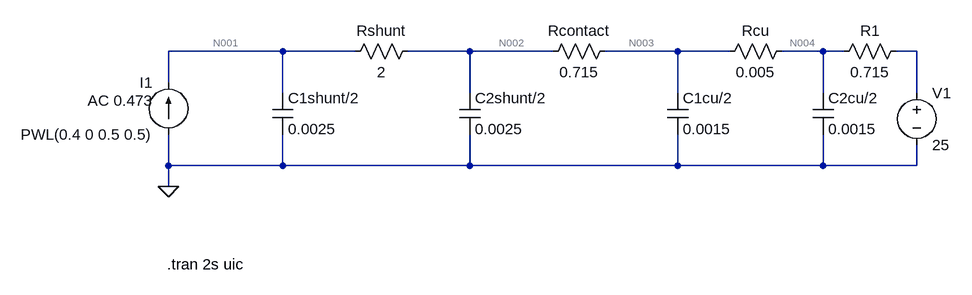
[diagram p0: schematic Draft1.asc]
Draft1.asc, the LTspice schematic file:
Version 4
SHEET 1 1048 680
WIRE -224 -64 -400 -64
WIRE -112 -64 -224 -64
WIRE 64 -64 -32 -64
WIRE 192 -64 64 -64
WIRE 384 -64 272 -64
WIRE 464 -64 384 -64
WIRE 608 -64 544 -64
WIRE 640 -64 608 -64
WIRE 752 -64 720 -64
WIRE -400 -16 -400 -64
WIRE -224 0 -224 -64
WIRE 64 0 64 -64
WIRE 384 0 384 -64
WIRE 608 0 608 -64
WIRE 752 0 752 -64
WIRE -400 112 -400 64
WIRE -224 112 -224 64
WIRE -224 112 -400 112
WIRE 64 112 64 64
WIRE 64 112 -224 112
WIRE 384 112 384 64
WIRE 384 112 64 112
WIRE 608 112 608 64
WIRE 608 112 384 112
WIRE 752 112 752 80
WIRE 752 112 608 112
WIRE -400 144 -400 112
FLAG -400 144 0
SYMBOL current -400 64 R180
WINDOW 0 24 80 Left 2
WINDOW 3 24 0 Left 2
WINDOW 123 24 52 Left 2
WINDOW 39 0 0 Left 2
SYMATTR InstName I1
SYMATTR Value PWL(0.4 0 0.5 0.5)
SYMATTR Value2 AC 0.473
SYMBOL res -16 -80 R90
WINDOW 0 0 56 VBottom 2
WINDOW 3 32 56 VTop 2
SYMATTR InstName Rshunt
SYMATTR Value 2
SYMBOL res 288 -80 R90
WINDOW 0 0 56 VBottom 2
WINDOW 3 32 56 VTop 2
SYMATTR InstName Rcontact
SYMATTR Value 0.715
SYMBOL res 560 -80 R90
WINDOW 0 0 56 VBottom 2
WINDOW 3 32 56 VTop 2
SYMATTR InstName Rcu
SYMATTR Value 0.005
SYMBOL voltage 752 -16 R0
WINDOW 123 24 124 Left 2
WINDOW 39 0 0 Left 2
SYMATTR InstName V1
SYMATTR Value 25
SYMBOL cap -240 0 R0
SYMATTR InstName C1shunt/2
SYMATTR Value 0.0025
SYMBOL cap 48 0 R0
SYMATTR InstName C2shunt/2
SYMATTR Value 0.0025
SYMBOL cap 368 0 R0
SYMATTR InstName C1cu/2
SYMATTR Value 0.0015
SYMBOL cap 592 0 R0
SYMATTR InstName C2cu/2
SYMATTR Value 0.0015
SYMBOL res 736 -80 R90
WINDOW 0 0 56 VBottom 2
WINDOW 3 32 56 VTop 2
SYMATTR InstName R1
SYMATTR Value 0.715
TEXT -402 264 Left 2 !.tran 2s uic

The netlist it stands for:
* Draft1.asc
I1 0 N001 PWL(0.4 0 0.5 0.5) AC 0.473
Rshunt N002 N001 2
Rcontact N003 N002 0.715
Rcu N004 N003 0.005
V1 N005 0 25
C1shunt/2 N001 0 0.0025
C2shunt/2 N002 0 0.0025
C1cu/2 N003 0 0.0015
C2cu/2 N004 0 0.0015
R1 N005 N004 0.715
.tran 2s uic
.backanno
.end

* Results of the author's LTspice run, read from the files saved beside the schematic
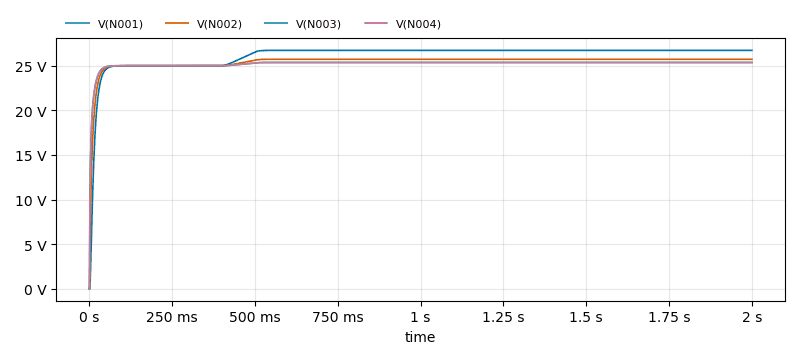
[diagram p1: Transient Analysis of Draft1.asc, plotted from the saved traces]
* Transient Analysis, 1 run:
*   V(N001): min 0 V, max 26.72 V, average 26.14 V, rms 26.21 V, last 26.72 V
*   V(N002): min 0 V, max 25.72 V, average 25.43 V, rms 25.47 V, last 25.72 V
*   V(N003): min 0 V, max 25.36 V, average 25.2 V, rms 25.22 V, last 25.36 V
*   V(N004): min 0 V, max 25.36 V, average 25.2 V, rms 25.22 V, last 25.36 V